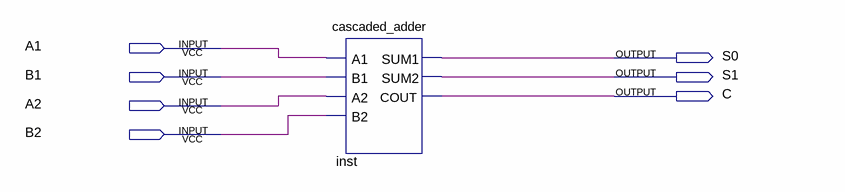
[diagram p0: schematic sheet]
// Quartus schematic top_level.bdf as structural Verilog: 1 symbols, 7 pins
module top_level (
  input  A1,
  input  B1,
  input  A2,
  input  B2,
  output S0,
  output S1,
  output C
);

  cascaded_adder inst (.A1(A1), .B1(B1), .A2(A2), .B2(B2), .SUM1(S0), .SUM2(S1), .COUT(C));
endmodule
